# Altium schematic sheet FPGA.SchDoc
size 420 x 297 mm; DocumentNumber: 11; SheetNumber: 11; SheetTotal: 17
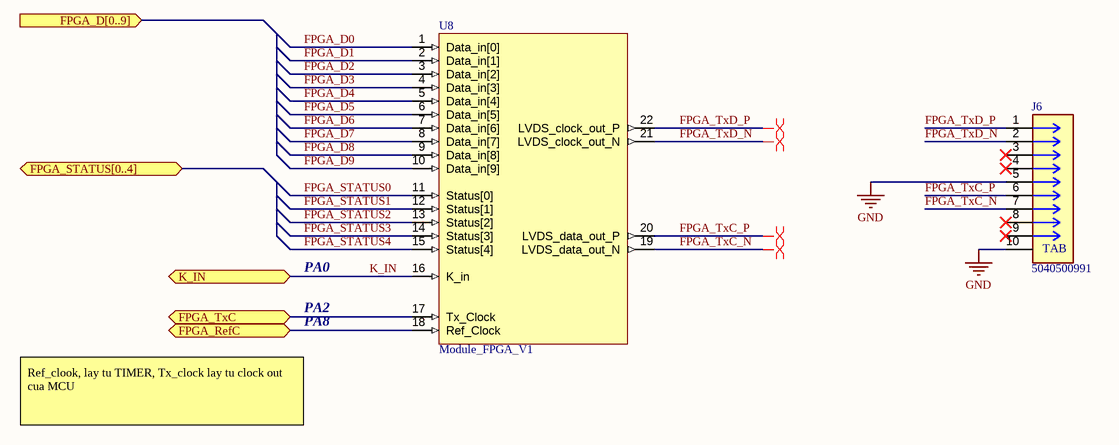
[diagram p0: FPGA.SchDoc]

## Parts
J6  5040500991  [5040500991]
U8  Module_FPGA_V1  [MODULE_FPGA]

## Ports
FPGA_D[0..9] (in), FPGA_RefC (bidir), FPGA_STATUS[0..4] (bidir), FPGA_TxC (bidir), K_IN (bidir)

## Nets
GND: J6.5 J6.10
FPGA_D0: U8.1(Data_in[0])
FPGA_D1: U8.2(Data_in[1])
FPGA_D2: U8.3(Data_in[2])
FPGA_D3: U8.4(Data_in[3])
FPGA_D4: U8.5(Data_in[4])
FPGA_D5: U8.6(Data_in[5])
FPGA_D6: U8.7(Data_in[6])
FPGA_D7: U8.8(Data_in[7])
FPGA_D8: U8.9(Data_in[8])
FPGA_D9: U8.10(Data_in[9])
FPGA_RefC: U8.18(Ref_Clock) ; port FPGA_RefC
FPGA_STATUS0: U8.11(Status[0])
FPGA_STATUS1: U8.12(Status[1])
FPGA_STATUS2: U8.13(Status[2])
FPGA_STATUS3: U8.14(Status[3])
FPGA_STATUS4: U8.15(Status[4])
FPGA_TxC: U8.17(Tx_Clock) ; port FPGA_TxC
FPGA_TxC_N: J6.7 U8.19(LVDS_data_out_N)
FPGA_TxC_P: J6.6 U8.20(LVDS_data_out_P)
FPGA_TxD_N: J6.2 U8.21(LVDS_clock_out_N)
FPGA_TxD_P: J6.1 U8.22(LVDS_clock_out_P)
K_IN: U8.16(K_in) ; port K_IN

Not connected (* = marked no-connect by the designer): J6 3* 4* 8* 9*

## Layout directives
differential pair: FPGA_TxC_N, FPGA_TxC_P, FPGA_TxD_N, FPGA_TxD_P

## Notes on the sheet
- PA0
- PA2
- PA8
- Ref_clook, lay tu TIMER, Tx_clock lay tu clock out cua MCU
- Project:
- BEE-PC1
- Sub-system:
- NANORACK_EXP_CONTROLLER
- Design by:
- SANG HUYNH
- BAO BUI Q.
- Sheet title:
- Sheet
- A3
- of
- Checked by:
- Approved by:
- VU PHAM
- Revision:
- Document No:
- V1.2.2
- Size:
- Date:
- (in symbol 5040500991) TAB

## Library data of the parts
J6 = 5040500991: Connector Header Surface Mount, Right Angle 9 position 0.059" (1.50mm)